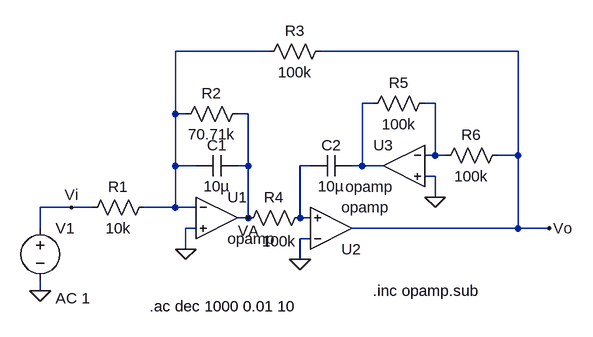
[diagram p0: schematic TS2.asc]
TS2.asc, the LTspice schematic file:
Version 4
SHEET 1 880 680
WIRE 224 -112 80 -112
WIRE 608 -112 304 -112
WIRE 384 -32 368 -32
WIRE 480 -32 464 -32
WIRE 80 -16 80 -112
WIRE 96 -16 80 -16
WIRE 192 -16 176 -16
WIRE 480 48 480 -32
WIRE 480 48 464 48
WIRE 496 48 480 48
WIRE 608 48 608 -112
WIRE 608 48 576 48
WIRE 80 64 80 -16
WIRE 112 64 80 64
WIRE 192 64 192 -16
WIRE 192 64 176 64
WIRE 288 64 272 64
WIRE 368 64 368 -32
WIRE 368 64 352 64
WIRE 400 64 368 64
WIRE 480 80 464 80
WIRE 480 112 480 80
WIRE -80 128 -128 128
WIRE -48 128 -80 128
WIRE 80 128 80 64
WIRE 80 128 32 128
WIRE 112 128 80 128
WIRE 192 144 192 64
WIRE 192 144 176 144
WIRE 272 144 272 64
WIRE 288 144 272 144
WIRE -128 160 -128 128
WIRE 112 160 96 160
WIRE 608 160 608 48
WIRE 608 160 352 160
WIRE 656 160 608 160
WIRE 288 176 272 176
WIRE 96 192 96 160
WIRE 272 208 272 176
WIRE -128 256 -128 240
FLAG 480 112 0
FLAG 96 192 0
FLAG 272 208 0
FLAG -80 128 Vi
FLAG 656 160 Vo
FLAG -128 256 0
FLAG 192 144 VA
SYMBOL OpAmps\\opamp 144 80 R0
SYMATTR InstName U1
SYMBOL OpAmps\\opamp 320 224 M180
SYMATTR InstName U2
SYMBOL OpAmps\\opamp 432 0 M0
SYMATTR InstName U3
SYMBOL res 48 112 R90
WINDOW 0 0 56 VBottom 2
WINDOW 3 32 56 VTop 2
SYMATTR InstName R1
SYMATTR Value 10k
SYMBOL res 192 -32 R90
WINDOW 0 0 56 VBottom 2
WINDOW 3 32 56 VTop 2
SYMATTR InstName R2
SYMATTR Value 70.71k
SYMBOL cap 176 48 R90
WINDOW 0 0 32 VBottom 2
WINDOW 3 32 32 VTop 2
SYMATTR InstName C1
SYMATTR Value 10µ
SYMBOL res 320 -128 R90
WINDOW 0 0 56 VBottom 2
WINDOW 3 32 56 VTop 2
SYMATTR InstName R3
SYMATTR Value 100k
SYMBOL res 288 128 R90
WINDOW 0 0 56 VBottom 2
WINDOW 3 36 48 VTop 2
SYMATTR InstName R4
SYMATTR Value 100k
SYMBOL res 480 -48 R90
WINDOW 0 0 56 VBottom 2
WINDOW 3 32 56 VTop 2
SYMATTR InstName R5
SYMATTR Value 100k
SYMBOL res 592 32 R90
WINDOW 0 0 56 VBottom 2
WINDOW 3 32 56 VTop 2
SYMATTR InstName R6
SYMATTR Value 100k
SYMBOL cap 352 48 R90
WINDOW 0 0 32 VBottom 2
WINDOW 3 32 32 VTop 2
SYMATTR InstName C2
SYMATTR Value 10µ
SYMBOL voltage -128 144 R0
WINDOW 123 24 124 Left 2
WINDOW 39 0 0 Left 0
SYMATTR Value2 AC 1
SYMATTR InstName V1
SYMATTR Value ""
TEXT 384 256 Left 2 !.inc opamp.sub
TEXT 40 280 Left 2 !.ac dec 1000 0.01 10

The netlist it stands for:
* TS2.asc
XU1 N001 0 VA opamp Aol=100K GBW=10Meg  ; pins invin noninvin out
XU2 0 N004 Vo opamp Aol=100K GBW=10Meg  ; pins invin noninvin out
XU3 N003 0 N002 opamp Aol=100K GBW=10Meg  ; pins invin noninvin out
R1 N001 Vi 10k
R2 VA N001 70.71k
C1 VA N001 10µ
R3 Vo N001 100k
R4 N004 VA 100k
R5 N003 N002 100k
R6 Vo N003 100k
C2 N002 N004 10µ
V1 Vi 0 AC 1
.inc opamp.sub
.ac dec 1000 0.01 10
.backanno
.end